# EAGLE design itrope-serial-v05 (EAGLE 7.7.0)
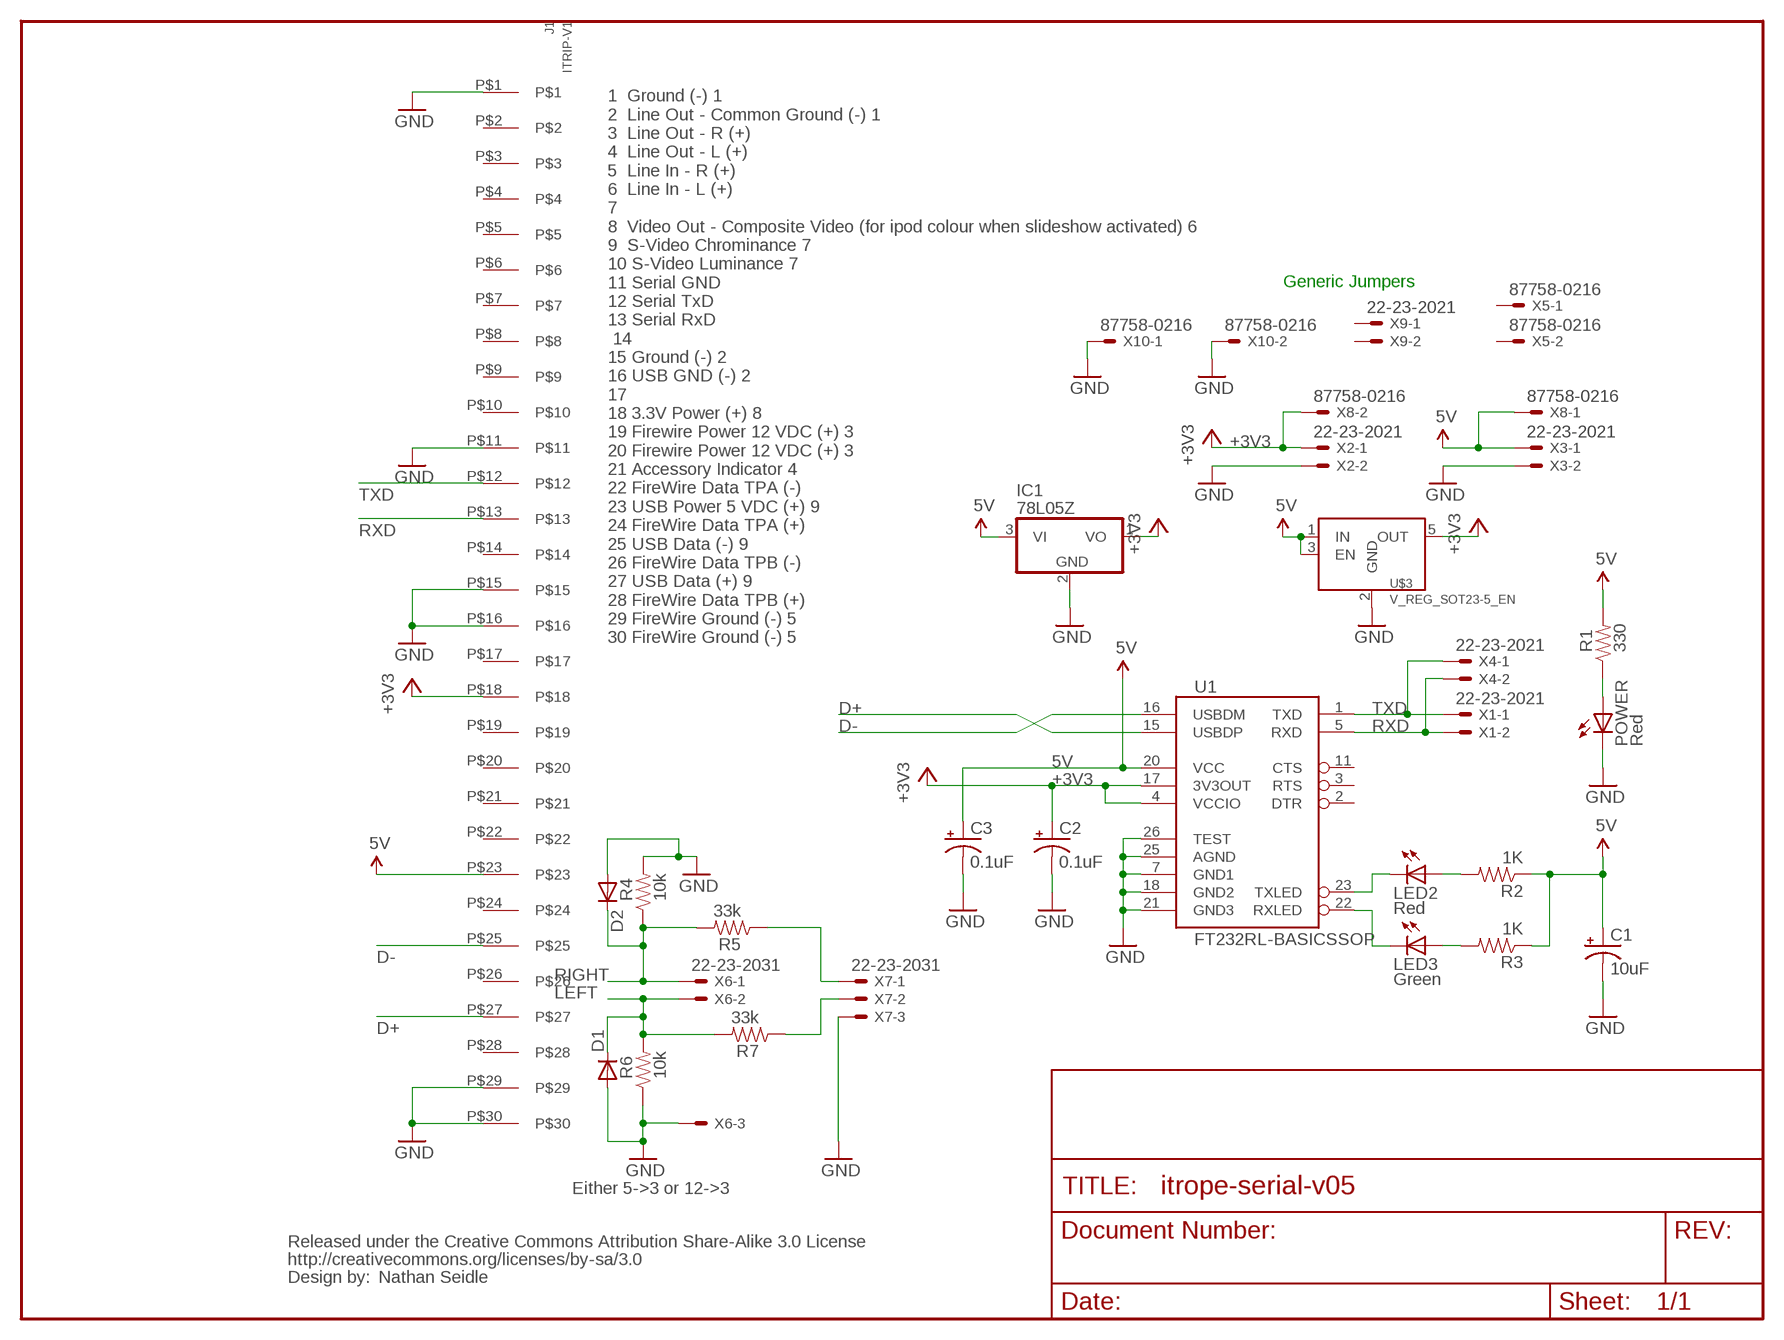
[diagram p0: schematic, sheet 1]

## Parts
C1  10uF  CPOL-USE2.5-5  [E2,5-5]
C2  0.1uF  CPOL-USE2.5-5  [E2,5-5]
C3  0.1uF  CPOL-USE2.5-5  [E2,5-5]
D1  DIODESOD  [SOD-323]
D2  DIODESOD  [SOD-323]
IC1  78L05Z  [TO92]
J1  ITRIP-V1  [30PINEDGE+ITRIP]
LED2  Red  LED0603  [LED-0603]
LED3  Green  LED0603  [LED-0603]
POWER  Red  LED0603  [LED-0603]
R1  330  RESISTOR0402  [C0402]
R2  1K  RESISTOR0402  [C0402]
R3  1K  RESISTOR0402  [C0402]
R4  10k  RESISTOR0402  [C0402]
R5  33k  RESISTOR0402  [C0402]
R6  10k  RESISTOR0402  [C0402]
R7  33k  RESISTOR0402  [C0402]
U1  FT232RL-BASICSSOP  [SSOP28DB]
U$3  V_REG_SOT23-5_EN  [SOT23-5]
U$9  CREATIVE_COMMONS  [CREATIVE_COMMONS]
X1  22-23-2021  [22-23-2021]
X2  22-23-2021  [22-23-2021]
X3  22-23-2021  [22-23-2021]
X4  22-23-2021  [22-23-2021]
X5  87758-0216  [87758-0216]
X6  22-23-2031  [22-23-2031]
X7  22-23-2031  [22-23-2031]
X8  87758-0216  [87758-0216]
X9  22-23-2021  [22-23-2021]
X10  87758-0216  [87758-0216]

## Nets
5V [vcc]: C1.+ C3.+ IC1.3(VI) J1.P$23 R1.2 R2.1 R3.1 U1.20(VCC) U$3.1(IN) U$3.3(EN) X3.1 X8.1
+3V3: C2.+ IC1.1(VO) J1.P$18 U1.4(VCCIO) U1.17(3V3OUT) U$3.5(OUT) X2.1 X8.2
D+: J1.P$27 U1.15(USBDP)
D-: J1.P$25 U1.16(USBDM)
GND [vcc]: C1.- C2.- C3.- D1.2(A) D2.2(A) IC1.2(GND) J1.P$1 J1.P$11 J1.P$15 J1.P$16 J1.P$29 J1.P$30 POWER.C R4.2 R6.1 U1.7(GND1) U1.18(GND2) U1.21(GND3) U1.25(AGND) U1.26(TEST) U$3.2(GND) X2.2 X3.2 X6.3 X7.3 X10.1 X10.2
LEFT: D1.1(C) R6.2 R7.2 X6.2
N$1: POWER.A R1.1
N$2: R7.1 X7.2
N$3: LED2.A R2.2
N$4: LED3.A R3.2
N$5: R5.1 X7.1
RIGHT: D2.1(C) R4.1 R5.2 X6.1
RXD: J1.P$13 U1.5(RXD) X1.2 X4.2
RXLED: LED3.C U1.22(RXLED)
TXD: J1.P$12 U1.1(TXD) X1.1 X4.1
TXLED: LED2.C U1.23(TXLED)
Unconnected: J1.P$2 J1.P$3 J1.P$4 J1.P$5 J1.P$6 J1.P$7 J1.P$8 J1.P$9 J1.P$10 J1.P$14 J1.P$17 J1.P$19 J1.P$20 J1.P$21 J1.P$22 J1.P$24 J1.P$26 J1.P$28 U1.2(DTR) U1.3(RTS) U1.11(CTS) X5.1 X5.2 X9.1 X9.2

## Notes on the sheet
- Generic Jumpers
- 1  Ground (-) 1
  2  Line Out - Common Ground (-) 1
  3  Line Out - R (+)
  4  Line Out - L (+)
  5  Line In - R (+)
  6  Line In - L (+)
  7
  8  Video Out - Composite Video (for ipod colour when slideshow activated) 6
  9  S-Video Chrominance 7
  10 S-Video Luminance 7
  11 Serial GND
  12 Serial TxD
  13 Serial RxD
   14
  15 Ground (-) 2
  16 USB GND (-) 2
  17
  18 3.3V Power (+) 8
  19 Firewire Power 12 VDC (+) 3
  20 Firewire Power 12 VDC (+) 3
  21 Accessory Indicator 4
  22 FireWire Data TPA (-)
  23 USB Power 5 VDC (+) 9
  24 FireWire Data TPA (+)
  25 USB Data (-) 9
  26 FireWire Data TPB (-)
  27 USB Data (+) 9
  28 FireWire Data TPB (+)
  29 FireWire Ground (-) 5
  30 FireWire Ground (-) 5
- Either 5->3 or 12->3
- Nathan Seidle

## Library data of the parts
C1-C3 = rcl:CPOL-US: POLARIZED CAPACITOR, American symbol
D1 D2 = LITTLEBITS:DIODE: Diode These are standard reverse protection diodes and small signal diodes. SMA package can handle up to about 1A. SOD-323 can handle about 200mA. What the SOD-323 package when ordering, there are some mfgs out there that are 5-pin packages.
IC1 = linear:78*: Positive VOLTAGE REGULATOR Source: http://cache.national.com/ds/LM/LM78L05.pdf http://www.fairchildsemi.com/ds/LM/LM7805.pdf
J1 = con-jae-IPOD-edgecard:ITRIP-V1
LED2 LED3 POWER = SparkFun:LED: LEDs Standard schematic elements and footprints for 5mm, 3mm, 1206, and 0603 sized LEDs. 5mm - Spark Fun Electronics SKU : COM-00529 (and others)
R1-R7 = SparkFun:RESISTOR: Resistor Basic schematic elements and footprints for 0603, 1206, and PTH 1/10th watt (small) resistors.
U1 = SparkFun:FT232RL-BASIC: USB UART This is the simplified version of the FT232RL unit. Only what you need, nothing you don't. Spark Fun Electronics SKU : COM-00650
U$3 = LITTLEBITS:V_REG_SOT23-5_EN: Generic device for a SOT23-5 surface mount LDO voltage regulator
U$9 = SparkFun:CREATIVE_COMMONS
X1-X4 X9 = con-molex:22-23-2021: .100" (2.54mm) Center Header - 2 Pin; MF: MOLEX; MPN: 22-23-2021; OC_FARNELL: 1462926; OC_NEWARK: 25C3832
X5 X8 X10 = con-molex:87758-0216: 2 Pin - 2mm Dual Row Single Wafer, Vertical T/H HDR Source: http://www.molex.com/pdm_docs/sd/877580616_sd.pdf; MPN: 87758-0216; OC_FARNELL: unknown; OC_NEWARK: 94M1513
X6 X7 = con-molex:22-23-2031: .100" (2.54mm) Center Header - 3 Pin; MF: MOLEX; MPN: 22-23-2031; OC_FARNELL: 1462950; OC_NEWARK: 30C0862

## Net classes
1 vcc: width 0.203 mm

## Board
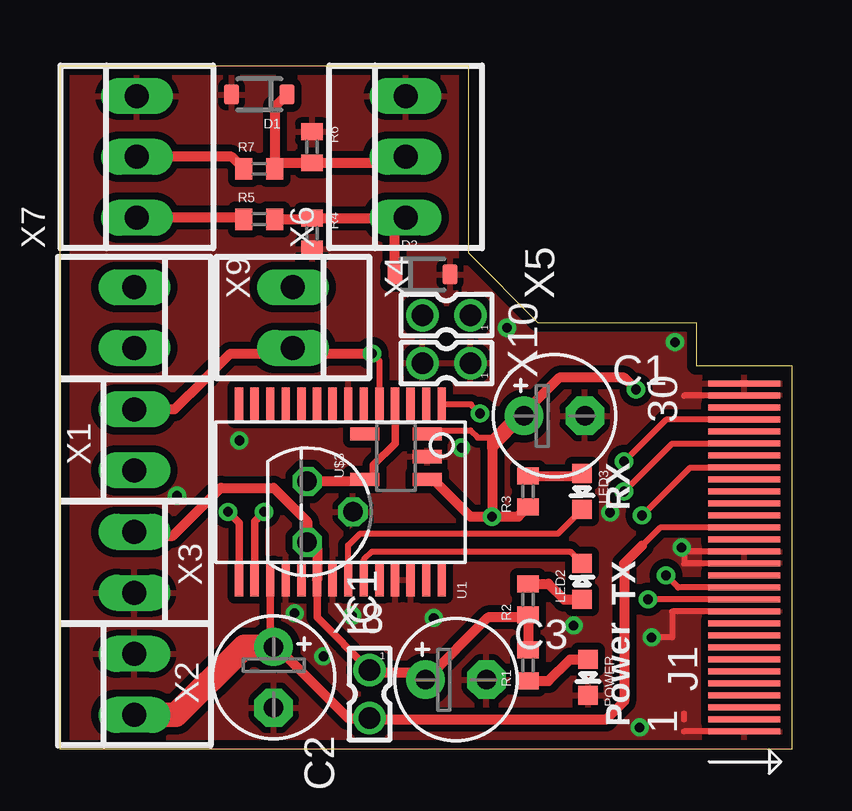
[diagram p1: board, top side]
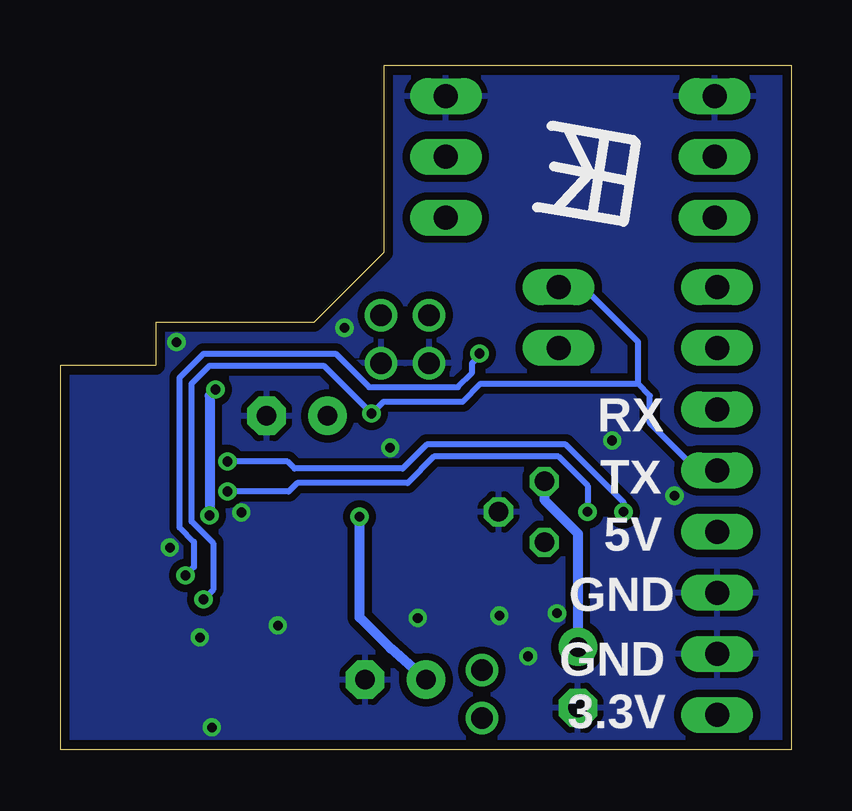
[diagram p2: board, bottom side, seen from below]

Size 30.48 x 28.5 mm. Coordinates in mm from the lower left corner, seen from the top.
Outline: 0,28.5 17,28.5 17,20.7 19.9,17.8 26.5,17.8 26.5,16 30.48,16 30.48,0 0,0 0,28.5
Copper layers (1*16): Top 0.0356mm / dielectric 1.5011mm / Bottom 0.0356mm
Design rules "LaenPCBOrder": minimum track width 6mil, minimum drill 13mil, track to track 6mil, track to pad 6mil, pad to pad 6mil, via to via 6mil, smd to smd 6mil, copper to edge 15mil, drill to drill 6mil, minimum pad ring 7mil, minimum via ring 7mil, stop-mask expansion 3mil, vias tented up to drill 0mil, thermal gap 10mil

### Footprints (pad centres in the part's own frame; a part is rotated, then mirrored left to right if it is on the bottom)
E2,5-5 = drill 0.813 pad 1.6: + -1.27,0 | drill 0.813 pad 1.6 octagon: - 1.27,0
SOD-323 = smd 0.63 x 0.83: 1 -1.15,0; 2 1.15,0
TO92 = drill 0.813 octagon: 1 -1.27,0; 2 0,1.905; 3 1.27,0
30PINEDGE+ITRIP = smd 0.25 x 3: P$1 7.25,1.5; P$2 6.75,1.5; P$3 6.25,1.5; P$4 5.75,1.5; P$5 5.25,1.5; P$6 4.75,1.5; P$7 4.25,1.5; P$8 3.75,1.5; P$9 3.25,1.5; P$10 2.75,1.5; P$11 2.25,1.5; P$12 1.75,1.5; P$13 1.25,1.5; P$14 0.75,1.5; P$15 0.25,1.5; P$16 -0.25,1.5; P$17 -0.75,1.5; P$18 -1.25,1.5; P$19 -1.75,1.5; P$20 -2.25,1.5; P$21 -2.75,1.5; P$22 -3.25,1.5; P$23 -3.75,1.5; P$24 -4.25,1.5; P$25 -4.75,1.5; P$26 -5.25,1.5; P$27 -5.75,1.5; P$28 -6.25,1.5; P$29 -6.75,1.5; P$30 -7.25,1.5
LED-0603 = smd 0.8 x 0.8: A 0,-0.75; C 0,0.75
C0402 = smd 0.7 x 0.9: 1 -0.65,0; 2 0.65,0
SSOP28DB = smd 0.348 x 1.397: 1 -4.225,-3.656; 2 -3.575,-3.656; 3 -2.925,-3.656; 4 -2.275,-3.656; 5 -1.625,-3.656; 6 -0.975,-3.656; 7 -0.325,-3.656; 8 0.325,-3.656; 9 0.975,-3.656; 10 1.625,-3.656; 11 2.275,-3.656; 12 2.925,-3.656; 13 3.575,-3.656; 14 4.225,-3.656; 15 4.225,3.656; 16 3.575,3.656; 17 2.925,3.656; 18 2.275,3.656; 19 1.625,3.656; 20 0.975,3.656; 21 0.325,3.656; 22 -0.325,3.656; 23 -0.975,3.656; 24 -1.625,3.656; 25 -2.275,3.656; 26 -2.925,3.656; 27 -3.575,3.656; 28 -4.225,3.656
SOT23-5 = smd 0.55 x 1.2: 1 -0.95,-1.3; 2 0,-1.3; 3 0.95,-1.3; 4 0.95,1.3; 5 -0.95,1.3
22-23-2021 = drill 1 long: 1 -1.27,0; 2 1.27,0
87758-0216 = drill 0.9 pad 1.27: 1 0,-1; 2 0,1
22-23-2031 = drill 1 long: 1 -2.54,0; 2 0,0; 3 2.54,0

### Placement (x,y rotation side)
C1  20.6,13.9 0 top
C2  8.9,3 270 top
C3  16.5,2.9 0 top
D1  8.3,27.3 180 top
D2  15.1,19.8 0 top
IC1  10.3,9.9 270 top
J1  27,8 270 top
LED2  21.75,7 0 top
LED3  21.75,10.75 180 top
POWER  22,3 180 top
R1  19.5,3.5 90 top
R2  19.5,6.25 90 top
R3  19.5,10.75 90 top
R4  10.5,21.5 270 top
R5  8.3,22.1 0 top
R6  10.5,25.1 270 top
R7  8.3,24.2 0 top
U1  11.68,10.72 180 top
U$3  14,12.2 90 top
U$9  -9.18,-27.14 0 top  (outside the outline)
X1  3.1,12.9 90 top
X2  3.1,2.7 90 top
X3  3.1,7.8 270 top
X4  9.7,18 270 top
X5  16.1,18.1 90 top
X6  14.4,24.7 90 top
X7  3.2,24.7 90 top
X8  12.9,2.3 180 top
X9  3.1,18 270 top
X10  16.1,16.1 90 top

### Tracks (layer width: path | path; a pad name or v marks a point on that pad's centre or on a via)
5V  (via drill 0.4)
  Top 0.254: 19.3,10.09 R3.1 | v24.25,9.75 26.25,11.75 J1.P$23 | 19.18,13.9 19.3,13.9 C1.+ 18.43,13 | U$3.3 15.3,13.05 15.55,13.3 17.1,13.3 17.4,13 17.9,13 18,12.9
  Top 0.305: U1.20 10.71,5.49 X8.1
  Top 0.406: v24,15 23.5,15.5 20.81,15.5 19.33,14.02 C1.+ 18,12.57 | 19.35,4 R1.2 R2.1 19.4,5.5 17.83,5.5 C3.+ 14.93,3.2 13,3.2 X8.1 | 19.4,10 R3.1 19.1,9.7 v18,9.7 | 18,12.57 v18,9.7 | U1.20 10.71,8.39 10.4,8.7 10.33,8.63 IC1.3 10.3,9.5 8.9,10.9 6.7,10.9 4.7,8.9 3.1,8.9 X3.1 | 18,12.57 18,12.9 18.8,13.7 19,13.7 19.3,14 19.3,13.9 | U$3.1 15.55,11.25 17.1,9.7 v18,9.7
  Bottom 0.406: v18,9.7 18,5.5 16.7,4.2 C3.+ | v24,15 24.25,14.75 v24.25,9.75
+3V3
  Top 0.254: J1.P$18 25,9.25 24.25,8.5
  Top 0.305: U1.4 13.96,12.76 13.05,11.85 13.05,11.25 U$3.5 | 8.76,4.63 8.9,4.49 C2.+ 8.76,4.41 U1.17
  Top 0.406: 24.25,8.5 23.5,7.75 23.5,2 22.75,1.25 12.95,1.25 X8.2 12,1.3 9.03,4.27 C2.+ | U$3.5 12.62,11.17 IC1.1
  Top 1.016: X2.1 4.83,1.43 7.67,4.27 C2.+
  Bottom 0.254: 8.8,4.37 C2.+
  Bottom 0.406: IC1.1 10.3,10.4 8.9,9 C2.+
D+  (via drill 0.4)
  Top 0.254: J1.P$27 25.25,13.75 v23.5,12
  Top 0.305: v7,9.9 7.46,9.44 U1.15
  Bottom 0.254: v7,9.9 7,10.3 9.4,12.7 15.2,12.7 16.2,11.7 20.7,11.7 21,12 v23.5,12
D-  (via drill 0.4)
  Top 0.254: v23.5,10.75 25.5,12.75 J1.P$25
  Top 0.305: v8.5,9.9 8.11,9.51 U1.16
  Bottom 0.254: v8.5,9.9 8.5,11 9.7,12.2 14.9,12.2 16,11.1 20.6,11.1 20.95,10.75 v23.5,10.75
GND  (via drill 0.4)
  Top 0.254: 12.06,14.32 U1.7 | 26,1.25 26,1.5 | J1.P$29 26,14.75 | J1.P$16 26,8.25 26,7.75 J1.P$15 | J1.P$11 25.5,5.75 25.5,4.66 v24.65,4.66 | J1.P$1 26,0.75
  other vias: 24.15,0.91 21.4,5.16 25.9,8.41 15.57,5.47 10.97,3.87 9.77,5.67 12.17,5.57 7.47,12.87 4.87,10.57 16.72,12.57 22.92,9.87 18.62,17.57 25.62,16.97
  pour Top (isolate 0.3): 0,0 0,28.4 17.05,28.45 17.05,22.55 19.9,19.7 26.5,19.7 26.5,16.1 30.48,16.1 30.48,0
  pour Bottom (isolate 0.305): 0,0 0,28.4 17,28.5 17,22.6 19.9,19.7 26.5,19.7 26.5,16.1 30.48,16.1 30.48,0
LEFT
  Top 0.406: X6.2 14.35,24.45 R6.2 9.2,24.45 R7.2 8.95,26.8 D1.1
N$1
  Top 0.254: POWER.A 21.84,3.87 21.73,3.75
  Top 0.406: R1.1 20.35,2.85 21.25,3.75 POWER.A
N$2
  Top 0.406: R7.1 7.15,24.7 X7.2
N$3
  Top 0.406: R2.2 20.35,6.9 21,6.25 LED2.A
N$4
  Top 0.406: R3.2 21.65,11.4 LED3.A
N$5
  Top 0.406: R5.1 7.59,22.16 X7.1
RIGHT
  Top 0.305: 13.95,22.05 13.9,22.1
  Top 0.406: 13.6,22.1 13.9,22.1 14.54,22.1 X6.1 | R5.2 10.45,22.1 R4.1 14.59,22.15 X6.1 | D2.1 13.95,21.51 X6.1
RXD  (via drill 0.4)
  Top 0.254: v13,16.5 13.31,16.19 U1.5 | J1.P$13 25.75,6.75 v25.25,7.25
  Top 0.406: 9.7,16.5 7.1,16.5 6.1,15.5 6,15.4 4.77,14.17 X1.2 | 9.7,16.5 v13,16.5 | 9.57,16.62 9.65,16.55 | 9.65,16.55 9.7,16.5 | X4.2 9.65,16.68 9.65,16.55
  Bottom 0.254: v25.25,7.25 24.9,7.6 24.9,8.65 25.5,9.25 25.5,15.5 24.5,16.5 19,16.5 17.6,15.1 13.9,15.1 13.31,15.69 13.31,16.1 13,16.41 v13,16.5
RXLED
  Top 0.254: U1.22 12.01,8.51 12.5,9 20.75,9 LED3.C
TXD  (via drill 0.4)
  Top 0.254: v17.5,14 17.12,14.38 U1.1 | J1.P$12 v24.5,6.25
  Bottom 0.254: v24.5,6.25 24.1,6.65 24.1,8.6 25,9.5 25,15.25 24.25,16 19.5,16 v17.5,14 17,14.5 13.7,14.5 12.96,15.24 6.4,15.24 | X4.1 8.67,19.27 6.4,17 6.4,15.24 | X1.1 3.27,11.8 4.1,11.8 5.9,13.6 5.9,14.74 6.4,15.24
TXLED
  Top 0.254: U1.23 12.66,7.91 13,8.25 21.25,8.25 LED2.C

### Text on the board
tPlace: RX | TX | Power
bPlace: RX | TX | 5V | GND | GND | 3.3V
Measures: R | L